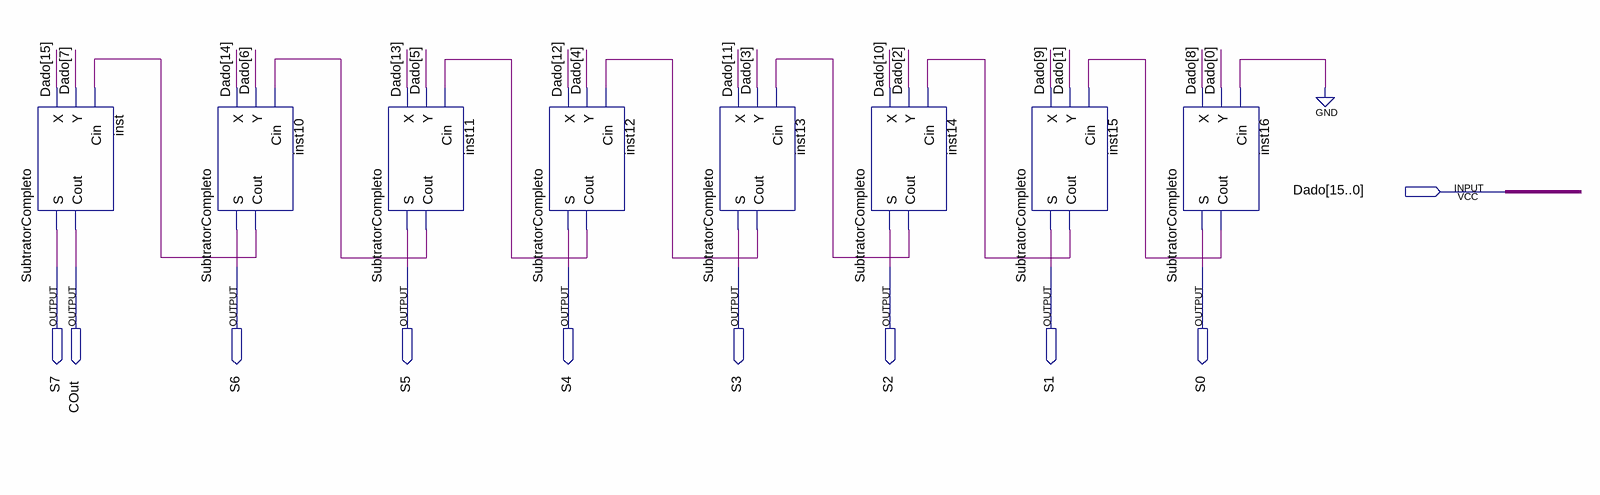
[diagram p0: schematic sheet]
// Quartus schematic Subtrator8Bits.bdf as structural Verilog: 8 symbols, 10 pins
module Subtrator8Bits (
  input  [15:0] Dado,
  output S7,
  output COut,
  output S6,
  output S5,
  output S4,
  output S3,
  output S2,
  output S1,
  output S0
);

  wire inst10_cout, inst11_cout, inst12_cout, inst13_cout, inst14_cout, inst15_cout, inst16_cout;

  SubtratorCompleto inst (.X(Dado[15]), .Y(Dado[7]), .Cin(inst10_cout), .S(S7), .Cout(COut));
  SubtratorCompleto inst10 (.X(Dado[14]), .Y(Dado[6]), .Cin(inst11_cout), .S(S6), .Cout(inst10_cout));
  SubtratorCompleto inst11 (.X(Dado[13]), .Y(Dado[5]), .Cin(inst12_cout), .S(S5), .Cout(inst11_cout));
  SubtratorCompleto inst12 (.X(Dado[12]), .Y(Dado[4]), .Cin(inst13_cout), .S(S4), .Cout(inst12_cout));
  SubtratorCompleto inst13 (.X(Dado[11]), .Y(Dado[3]), .Cin(inst14_cout), .S(S3), .Cout(inst13_cout));
  SubtratorCompleto inst14 (.X(Dado[10]), .Y(Dado[2]), .Cin(inst15_cout), .S(S2), .Cout(inst14_cout));
  SubtratorCompleto inst15 (.X(Dado[9]), .Y(Dado[1]), .Cin(inst16_cout), .S(S1), .Cout(inst15_cout));
  SubtratorCompleto inst16 (.X(Dado[8]), .Y(Dado[0]), .Cin(1'b0), .S(S0), .Cout(inst16_cout));
endmodule
